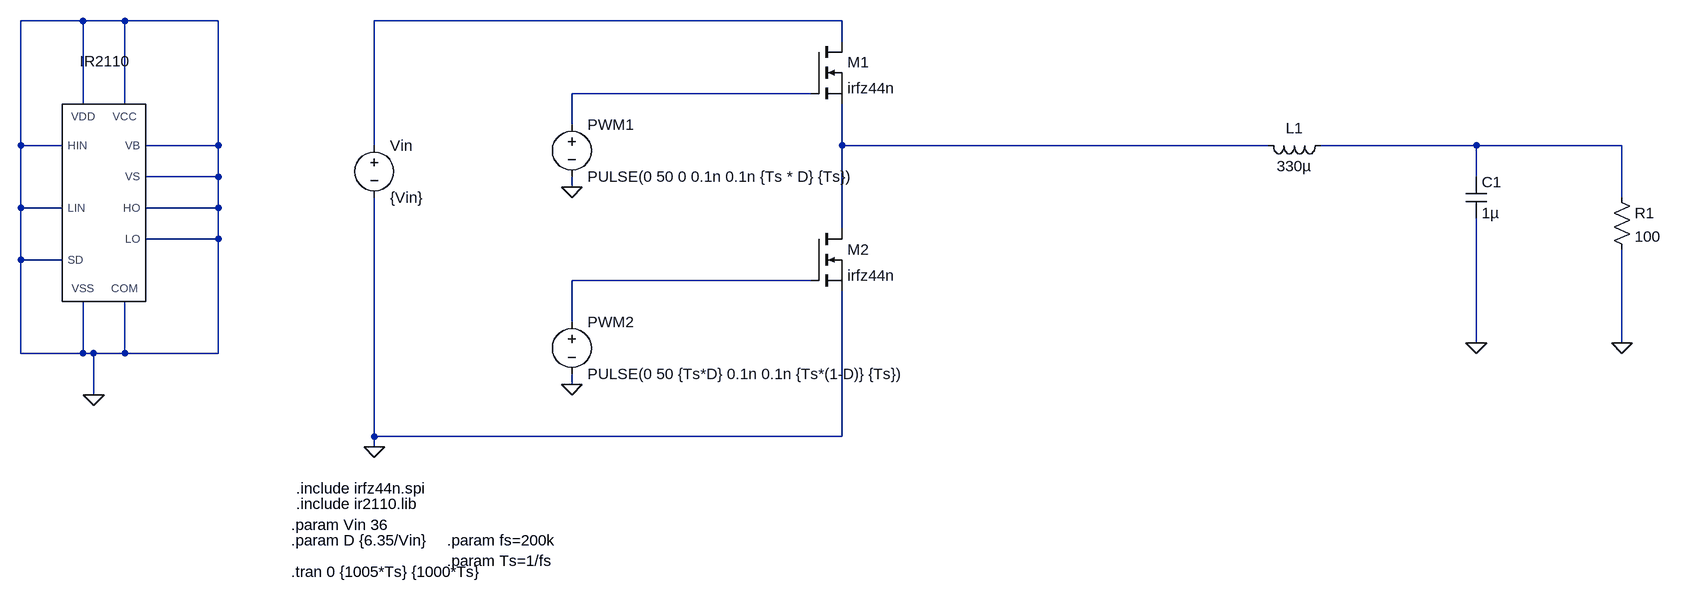
[diagram p0: schematic 04_11_04_buck_con_gate_driver.asc]
04_11_04_buck_con_gate_driver.asc, the LTspice schematic file:
Version 4
SHEET 1 1256 1008
WIRE -1200 0 -1296 0
WIRE -1136 0 -1200 0
WIRE -992 0 -1136 0
WIRE -32 0 -752 0
WIRE -32 32 -32 0
WIRE -80 112 -448 112
WIRE -1200 128 -1200 0
WIRE -1136 128 -1136 0
WIRE -448 160 -448 112
WIRE -1296 192 -1296 0
WIRE -1232 192 -1296 192
WIRE -992 192 -992 0
WIRE -992 192 -1104 192
WIRE -752 192 -752 0
WIRE -32 192 -32 128
WIRE 624 192 -32 192
WIRE 944 192 704 192
WIRE 1168 192 944 192
WIRE -992 240 -992 192
WIRE -992 240 -1104 240
WIRE 944 240 944 192
WIRE -448 256 -448 240
WIRE 1168 272 1168 192
WIRE -1296 288 -1296 192
WIRE -1232 288 -1296 288
WIRE -992 288 -992 240
WIRE -992 288 -1104 288
WIRE -32 320 -32 192
WIRE -992 336 -992 288
WIRE -992 336 -1104 336
WIRE -1296 368 -1296 288
WIRE -1232 368 -1296 368
WIRE -80 400 -448 400
WIRE -448 464 -448 400
WIRE 944 496 944 304
WIRE 1168 496 1168 352
WIRE -1296 512 -1296 368
WIRE -1200 512 -1200 432
WIRE -1200 512 -1296 512
WIRE -1184 512 -1200 512
WIRE -1136 512 -1136 432
WIRE -1136 512 -1184 512
WIRE -992 512 -992 336
WIRE -992 512 -1136 512
WIRE -448 560 -448 544
WIRE -1184 576 -1184 512
WIRE -752 640 -752 272
WIRE -32 640 -32 416
WIRE -32 640 -752 640
WIRE -752 656 -752 640
FLAG 944 496 0
FLAG -448 256 0
FLAG -448 560 0
FLAG -752 656 0
FLAG 1168 496 0
FLAG -1184 576 0
SYMBOL ind 720 176 R90
WINDOW 0 5 56 VBottom 2
WINDOW 3 32 56 VTop 2
SYMATTR InstName L1
SYMATTR Value 330µ
SYMBOL cap 928 240 R0
SYMATTR InstName C1
SYMATTR Value 1µ
SYMBOL voltage -752 176 R0
WINDOW 123 0 0 Left 0
WINDOW 39 0 0 Left 0
SYMATTR InstName Vin
SYMATTR Value {Vin}
SYMBOL voltage -448 144 R0
WINDOW 123 0 0 Left 0
WINDOW 39 0 0 Left 0
SYMATTR InstName PWM1
SYMATTR Value PULSE(0 50 0 0.1n 0.1n {Ts * D} {Ts})
SYMBOL voltage -448 448 R0
WINDOW 123 0 0 Left 0
WINDOW 39 0 0 Left 0
SYMATTR InstName PWM2
SYMATTR Value PULSE(0 50 {Ts*D} 0.1n 0.1n {Ts*(1-D)} {Ts})
SYMBOL res 1152 256 R0
SYMATTR InstName R1
SYMATTR Value 100
SYMBOL nmos -80 32 R0
SYMATTR InstName M1
SYMATTR Value irfz44n
SYMBOL nmos -80 320 R0
SYMATTR InstName M2
SYMATTR Value irfz44n
SYMBOL ir2110 -1168 240 R0
WINDOW 0 0 0 Invisible 0
SYMATTR InstName X1
SYMATTR SpiceModel ir2110
TEXT -640 800 Left 2 !.param fs=200k\n.param Ts=1/fs
TEXT -880 800 Left 2 !.param D {6.35/Vin}
TEXT -880 776 Left 2 !.param Vin 36
TEXT -880 848 Left 2 !.tran 0 {1005*Ts} {1000*Ts}
TEXT -872 720 Left 2 !.include irfz44n.spi
TEXT -872 744 Left 2 !.include ir2110.lib

The netlist it stands for:
* 04_11_04_buck_con_gate_driver.asc
L1 N004 N003 330µ
C1 N004 0 1µ
Vin N001 0 {Vin}
V§PWM1 N002 0 PULSE(0 50 0 0.1n 0.1n {Ts * D} {Ts})
V§PWM2 N005 0 PULSE(0 50 {Ts*D} 0.1n 0.1n {Ts*(1-D)} {Ts})
R1 N004 0 100
M1 N001 N002 N003 N003 irfz44n
M2 N003 N005 0 0 irfz44n
XX1 0 0 0 0 0 0 0 0 0 0 0 ir2110 IR2110  ; pins LO HO COM VSS LIN HIN VCC VB VS VDD SD
.model NMOS NMOS
.model PMOS PMOS
.lib standard.mos
.param fs=200k
.param Ts=1/fs
.param D {6.35/Vin}
.param Vin 36
.tran 0 {1005*Ts} {1000*Ts}
.include irfz44n.spi
.include ir2110.lib
.lib IR2110.lib
.backanno
.end